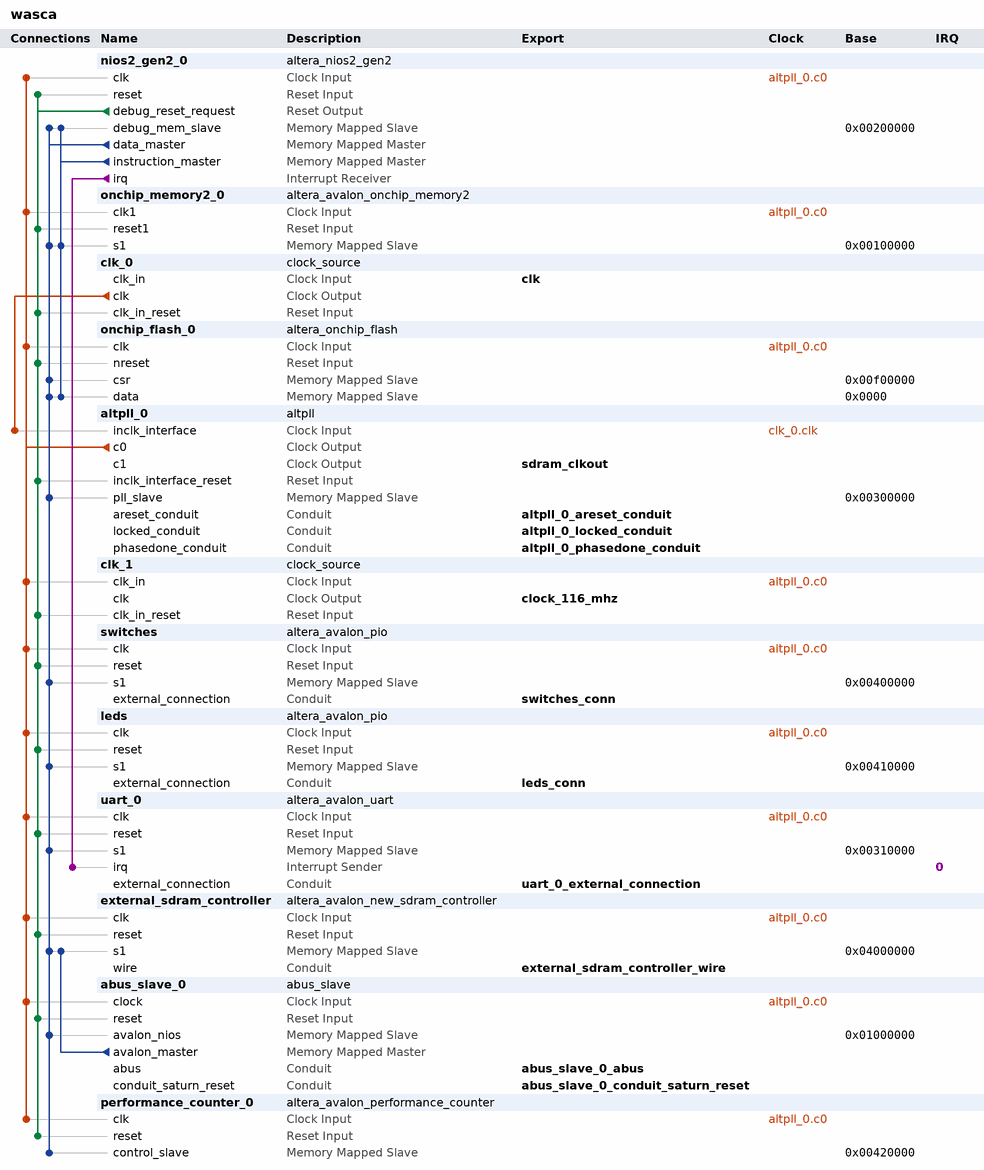
[diagram p0: system contents]
# Platform Designer (Qsys) system wasca, MAX 10 10M08SCE144C8G
# Parameters at their usual value, and those the tool derives, are not listed.
package require -exact qsys 15.1
create_system wasca
set_project_property DEVICE_FAMILY {MAX 10}
set_project_property DEVICE 10M08SCE144C8G

add_instance nios2_gen2_0 altera_nios2_gen2 15.1
set_instance_parameter_value nios2_gen2_0 dcache_size 0
set_instance_parameter_value nios2_gen2_0 debug_hwbreakpoint 4
set_instance_parameter_value nios2_gen2_0 exceptionSlave onchip_memory2_0.s1
set_instance_parameter_value nios2_gen2_0 icache_size 0
set_instance_parameter_value nios2_gen2_0 impl Tiny
set_instance_parameter_value nios2_gen2_0 resetSlave onchip_flash_0.data
set_instance_parameter_value nios2_gen2_0 resetrequest_enabled false

add_instance onchip_memory2_0 altera_avalon_onchip_memory2 15.1
set_instance_parameter_value onchip_memory2_0 dataWidth 32
set_instance_parameter_value onchip_memory2_0 dualPort false
set_instance_parameter_value onchip_memory2_0 initMemContent false
set_instance_parameter_value onchip_memory2_0 initializationFileName onchip_mem.hex
set_instance_parameter_value onchip_memory2_0 memorySize 32768

add_instance clk_0 clock_source 15.1
set_instance_parameter_value clk_0 clockFrequency 22579200

add_instance onchip_flash_0 altera_onchip_flash 15.1.1
set_instance_parameter_value onchip_flash_0 CONFIGURATION_MODE {Single Uncompressed Image}
set_instance_parameter_value onchip_flash_0 SECTOR_ACCESS_MODE {Read and write,Read and write,Read and write,Read and write,Read and write}
set_instance_parameter_value onchip_flash_0 initFlashContent false
set_instance_parameter_value onchip_flash_0 initializationFileName D:/github/wascafe/v12/firmware/hello/software/wasca_test9/mem_init/wasca_onchip_memory2_0.hex
set_instance_parameter_value onchip_flash_0 useNonDefaultInitFile true

add_instance altpll_0 altpll 15.1
set_instance_parameter_value altpll_0 CLK0_DIVIDE_BY 1
set_instance_parameter_value altpll_0 CLK0_MULTIPLY_BY 5
set_instance_parameter_value altpll_0 CLK1_DIVIDE_BY 1
set_instance_parameter_value altpll_0 CLK1_DUTY_CYCLE 50
set_instance_parameter_value altpll_0 CLK1_MULTIPLY_BY 5
set_instance_parameter_value altpll_0 CLK1_PHASE_SHIFT -1500
set_instance_parameter_value altpll_0 INCLK0_INPUT_FREQUENCY 44288
set_instance_parameter_value altpll_0 PORT_ARESET PORT_UNUSED
set_instance_parameter_value altpll_0 PORT_LOCKED PORT_USED
set_instance_parameter_value altpll_0 PORT_clk1 PORT_USED
set_instance_parameter_value altpll_0 PORT_clk2 PORT_UNUSED
set_instance_parameter_value altpll_0 PORT_clk3 PORT_UNUSED

add_instance clk_1 clock_source 15.1
set_instance_parameter_value clk_1 clockFrequency 115905533
set_instance_parameter_value clk_1 resetSynchronousEdges BOTH

add_instance switches altera_avalon_pio 15.1
set_instance_parameter_value switches direction Input
set_instance_parameter_value switches simDoTestBenchWiring true
set_instance_parameter_value switches width 3

add_instance leds altera_avalon_pio 15.1
set_instance_parameter_value leds direction Output
set_instance_parameter_value leds width 4

add_instance uart_0 altera_avalon_uart 15.1
set_instance_parameter_value uart_0 baud 115200
set_instance_parameter_value uart_0 dataBits 8
set_instance_parameter_value uart_0 fixedBaud false
set_instance_parameter_value uart_0 parity ODD
set_instance_parameter_value uart_0 stopBits 1

add_instance external_sdram_controller altera_avalon_new_sdram_controller 15.1
set_instance_parameter_value external_sdram_controller TAC 6.0
set_instance_parameter_value external_sdram_controller TRCD 18.0
set_instance_parameter_value external_sdram_controller TRFC 60.0
set_instance_parameter_value external_sdram_controller TRP 18.0
set_instance_parameter_value external_sdram_controller TWR 12.0
set_instance_parameter_value external_sdram_controller casLatency 2
set_instance_parameter_value external_sdram_controller columnWidth 9
set_instance_parameter_value external_sdram_controller dataWidth 16
set_instance_parameter_value external_sdram_controller generateSimulationModel false
set_instance_parameter_value external_sdram_controller model single_Micron_MT48LC4M32B2_7_chip
set_instance_parameter_value external_sdram_controller numberOfBanks 4
set_instance_parameter_value external_sdram_controller numberOfChipSelects 1
set_instance_parameter_value external_sdram_controller powerUpDelay 100.0
set_instance_parameter_value external_sdram_controller refreshPeriod 156.0
set_instance_parameter_value external_sdram_controller rowWidth 13

add_instance abus_slave_0 abus_slave 1.0

add_instance performance_counter_0 altera_avalon_performance_counter 15.1
set_instance_parameter_value performance_counter_0 numberOfSections 1

# connections
add_connection altpll_0.c0 abus_slave_0.clock clock
add_connection altpll_0.c0 clk_1.clk_in clock
add_connection altpll_0.c0 external_sdram_controller.clk clock
add_connection altpll_0.c0 leds.clk clock
add_connection altpll_0.c0 nios2_gen2_0.clk clock
add_connection altpll_0.c0 onchip_flash_0.clk clock
add_connection altpll_0.c0 onchip_memory2_0.clk1 clock
add_connection altpll_0.c0 performance_counter_0.clk clock
add_connection altpll_0.c0 switches.clk clock
add_connection altpll_0.c0 uart_0.clk clock
add_connection clk_0.clk altpll_0.inclk_interface clock
add_connection nios2_gen2_0.debug_reset_request abus_slave_0.reset reset
add_connection nios2_gen2_0.debug_reset_request altpll_0.inclk_interface_reset reset
add_connection nios2_gen2_0.debug_reset_request clk_0.clk_in_reset reset
add_connection nios2_gen2_0.debug_reset_request clk_1.clk_in_reset reset
add_connection nios2_gen2_0.debug_reset_request external_sdram_controller.reset reset
add_connection nios2_gen2_0.debug_reset_request leds.reset reset
add_connection nios2_gen2_0.debug_reset_request nios2_gen2_0.reset reset
add_connection nios2_gen2_0.debug_reset_request onchip_flash_0.nreset reset
add_connection nios2_gen2_0.debug_reset_request onchip_memory2_0.reset1 reset
add_connection nios2_gen2_0.debug_reset_request performance_counter_0.reset reset
add_connection nios2_gen2_0.debug_reset_request switches.reset reset
add_connection nios2_gen2_0.debug_reset_request uart_0.reset reset
add_connection abus_slave_0.avalon_master external_sdram_controller.s1 avalon
set_connection_parameter_value abus_slave_0.avalon_master/external_sdram_controller.s1 baseAddress 0x04000000
add_connection nios2_gen2_0.data_master abus_slave_0.avalon_nios avalon
set_connection_parameter_value nios2_gen2_0.data_master/abus_slave_0.avalon_nios baseAddress 0x01000000
add_connection nios2_gen2_0.data_master altpll_0.pll_slave avalon
set_connection_parameter_value nios2_gen2_0.data_master/altpll_0.pll_slave baseAddress 0x00300000
add_connection nios2_gen2_0.data_master external_sdram_controller.s1 avalon
set_connection_parameter_value nios2_gen2_0.data_master/external_sdram_controller.s1 baseAddress 0x04000000
add_connection nios2_gen2_0.data_master leds.s1 avalon
set_connection_parameter_value nios2_gen2_0.data_master/leds.s1 baseAddress 0x00410000
add_connection nios2_gen2_0.data_master nios2_gen2_0.debug_mem_slave avalon
set_connection_parameter_value nios2_gen2_0.data_master/nios2_gen2_0.debug_mem_slave baseAddress 0x00200000
add_connection nios2_gen2_0.data_master onchip_flash_0.csr avalon
set_connection_parameter_value nios2_gen2_0.data_master/onchip_flash_0.csr baseAddress 0x00f00000
add_connection nios2_gen2_0.data_master onchip_flash_0.data avalon
set_connection_parameter_value nios2_gen2_0.data_master/onchip_flash_0.data baseAddress 0x0000
add_connection nios2_gen2_0.data_master onchip_memory2_0.s1 avalon
set_connection_parameter_value nios2_gen2_0.data_master/onchip_memory2_0.s1 baseAddress 0x00100000
add_connection nios2_gen2_0.data_master performance_counter_0.control_slave avalon
set_connection_parameter_value nios2_gen2_0.data_master/performance_counter_0.control_slave baseAddress 0x00420000
add_connection nios2_gen2_0.data_master switches.s1 avalon
set_connection_parameter_value nios2_gen2_0.data_master/switches.s1 baseAddress 0x00400000
add_connection nios2_gen2_0.data_master uart_0.s1 avalon
set_connection_parameter_value nios2_gen2_0.data_master/uart_0.s1 baseAddress 0x00310000
add_connection nios2_gen2_0.instruction_master nios2_gen2_0.debug_mem_slave avalon
set_connection_parameter_value nios2_gen2_0.instruction_master/nios2_gen2_0.debug_mem_slave baseAddress 0x00200000
add_connection nios2_gen2_0.instruction_master onchip_flash_0.data avalon
set_connection_parameter_value nios2_gen2_0.instruction_master/onchip_flash_0.data baseAddress 0x0000
add_connection nios2_gen2_0.instruction_master onchip_memory2_0.s1 avalon
set_connection_parameter_value nios2_gen2_0.instruction_master/onchip_memory2_0.s1 baseAddress 0x00100000
add_connection nios2_gen2_0.irq uart_0.irq interrupt
set_connection_parameter_value nios2_gen2_0.irq/uart_0.irq irqNumber 0

# exported interfaces
add_interface abus_slave_0_abus conduit end
set_interface_property abus_slave_0_abus EXPORT_OF abus_slave_0.abus
add_interface abus_slave_0_conduit_saturn_reset conduit end
set_interface_property abus_slave_0_conduit_saturn_reset EXPORT_OF abus_slave_0.conduit_saturn_reset
add_interface altpll_0_areset_conduit conduit end
set_interface_property altpll_0_areset_conduit EXPORT_OF altpll_0.areset_conduit
add_interface altpll_0_locked_conduit conduit end
set_interface_property altpll_0_locked_conduit EXPORT_OF altpll_0.locked_conduit
add_interface altpll_0_phasedone_conduit conduit end
set_interface_property altpll_0_phasedone_conduit EXPORT_OF altpll_0.phasedone_conduit
add_interface clk clock sink
set_interface_property clk EXPORT_OF clk_0.clk_in
add_interface clock_116_mhz clock source
set_interface_property clock_116_mhz EXPORT_OF clk_1.clk
add_interface external_sdram_controller_wire conduit end
set_interface_property external_sdram_controller_wire EXPORT_OF external_sdram_controller.wire
add_interface leds_conn conduit end
set_interface_property leds_conn EXPORT_OF leds.external_connection
add_interface sdram_clkout clock source
set_interface_property sdram_clkout EXPORT_OF altpll_0.c1
add_interface switches_conn conduit end
set_interface_property switches_conn EXPORT_OF switches.external_connection
add_interface uart_0_external_connection conduit end
set_interface_property uart_0_external_connection EXPORT_OF uart_0.external_connection

set_interconnect_requirement {$system} qsys_mm.clockCrossingAdapter HANDSHAKE
set_interconnect_requirement {$system} qsys_mm.insertDefaultSlave FALSE
set_interconnect_requirement {$system} qsys_mm.maxAdditionalLatency 1

save_system wasca.qsys
